# Altium schematic sheet FLASH_PLEIADES.SchDoc
size Tabloid; SheetNumber: 5; SheetTotal: 5; Sheet_Name: Insert name in Document Parameters; Size: 11x17
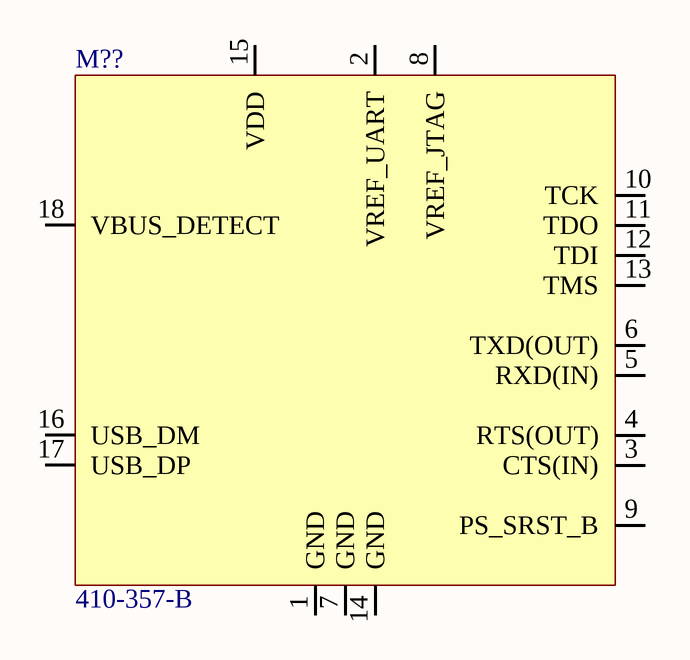
[diagram p0: FLASH_PLEIADES.SchDoc]

## Parts
M??  410-357-B  [MOD_JTAG_410-357-B]

## Nets

Not connected (* = marked no-connect by the designer): M?? 1(GND) 2(VREF_UART) 3(CTS(IN)) 4(RTS(OUT)) 5(RXD(IN)) 6(TXD(OUT)) 7(GND) 8(VREF_JTAG) 9(PS_SRST_B) 10(TCK) 11(TDO) 12(TDI) 13(TMS) 14(GND) 15(VDD) 16(USB_DM) 17(USB_DP) 18(VBUS_DETECT)

## Notes on the sheet
- Sheet Name
- Project Title
- Global Project
- Size
- Group
- Revision
- Date
- Sheet
- of
- Filename
- Designers

## Library data of the parts
M?? = MOD_JTAG_410-357-B: MOD - JTAG-SMT3-NC Programming Module For Xilinx FPGA - 18-SMT; Manufacturer #1: Digilent; Voltage Rating: VDD: 2.97V~3.63V, VJTAG/VUART: 1.65V~5.5V; GRAMS Lib Spec: 2.8; Note: Prior to reflow, the JTAG-SMT3-NC module must be dried at 125°C for 17 hours; Magnetic Material: Unknown; Polarized: Yes; Value: *; Tolerance: *; Current Rating: *; Power Max: *; HelpURL: https://reference.digilentinc.com/_media/reference/programmers/jtag-smt3/jtag-smt3-nc_rm.pdf; CreatedBy/Date: Tommy Rossignol 2018-11-23; VerifiedBy: Nicolas V. (2019-01-28); Temperature: -40°C ~ 85°C; Package: 18-pad SMT; Manufacturer #2: *; Assembly Type: SMD; Part Number #2: *; Part Number #1: 410-357-B; Supplier 1: Digi-Key; Supplier Part Number 1: 1286-1196-ND; Cryo: UNKNOWN